# Altium schematic sheet filter.SchDoc
size A4
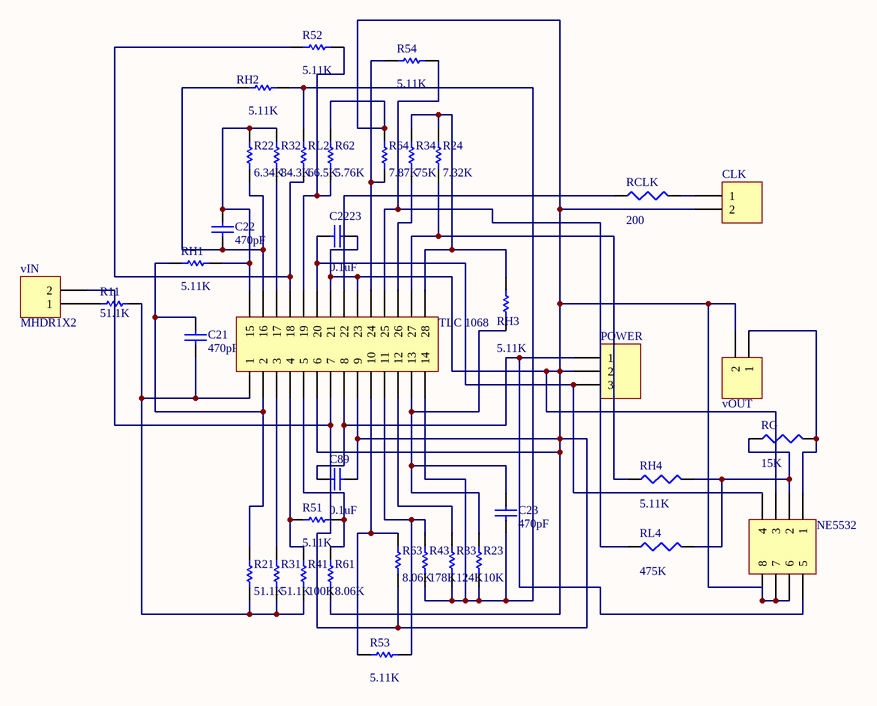
[diagram p0: filter.SchDoc]

## Parts
C21  value 470pF  [RAD-0.3]  (hidden comment: Cap)
C22  value 470pF  [RAD-0.3]  (hidden comment: Cap)
C23  value 470pF  [RAD-0.3]  (hidden comment: Cap)
C89  value 0.1uF  [RAD-0.3]  (hidden comment: Cap)
C2223  value 0.1uF  [RAD-0.3]  (hidden comment: Cap)
CLK  Header 2  [J2]  (value not drawn)
NE5532  Header 4X2A  [J8]  (value not drawn)
POWER  Header 3H  [J3]  (value not drawn)
R11  value 51.1K  [AXIAL-0.3]  (hidden comment: Res1)
R21  value 51.1K  [AXIAL-0.3]  (hidden comment: Res1)
R22  value 6.34K  [AXIAL-0.3]  (hidden comment: Res1)
R23  value 10K  [AXIAL-0.3]  (hidden comment: Res1)
R24  value 7.32K  [AXIAL-0.3]  (hidden comment: Res1)
R31  value 51.1K  [AXIAL-0.3]  (hidden comment: Res1)
R32  value 84.3K  [AXIAL-0.3]  (hidden comment: Res1)
R33  value 124K  [AXIAL-0.3]  (hidden comment: Res1)
R34  value 75K  [AXIAL-0.3]  (hidden comment: Res1)
R41  value 100K  [AXIAL-0.3]  (hidden comment: Res1)
R43  value 178K  [AXIAL-0.3]  (hidden comment: Res1)
R51  value 5.11K  [AXIAL-0.3]  (hidden comment: Res1)
R52  value 5.11K  [AXIAL-0.3]  (hidden comment: Res1)
R53  value 5.11K  [AXIAL-0.3]  (hidden comment: Res1)
R54  value 5.11K  [AXIAL-0.3]  (hidden comment: Res1)
R61  value 8.06K  [AXIAL-0.3]  (hidden comment: Res1)
R62  value 5.76K  [AXIAL-0.3]  (hidden comment: Res1)
R63  value 8.06K  [AXIAL-0.3]  (hidden comment: Res1)
R64  value 7.87K  [AXIAL-0.3]  (hidden comment: Res1)
RCLK  value 200  [AXIAL-0.3]  (hidden comment: RCLK)
RG  value 15K  [AXIAL-0.3]  (hidden comment: Res3)
RH1  value 5.11K  [AXIAL-0.3]  (hidden comment: Res1)
RH2  value 5.11K  [AXIAL-0.3]  (hidden comment: Res1)
RH3  value 5.11K  [AXIAL-0.3]  (hidden comment: Res1)
RH4  value 5.11K  [AXIAL-0.3]  (hidden comment: Res3)
RL2  value 66.5K  [AXIAL-0.3]  (hidden comment: Res1)
RL4  value 475K  [AXIAL-0.3]  (hidden comment: Res3)
TLC_1068  Header 14X2A  [J28]  (value not drawn)
vIN  MHDR1X2  [J2]
vOUT  MHDR1X2  [J2]  (value not drawn)

## Nets
NetC21_1: C21.1 R11.1 R21.1 R31.1 R41.1 TLC_1068.1
NetC21_2: C21.2 R21.2 RH1.2 TLC_1068.2
NetC22_1: C22.1 R22.1 RH2.1 TLC_1068.16
NetC22_2: C22.2 R22.2 R32.2 RH1.1 TLC_1068.15
NetC23_1: C23.1 R23.1 R33.1 R43.1 RH2.2 RL2.2 TLC_1068.14
NetC23_2: C23.2 R23.2 RH3.1 TLC_1068.13
NetC89_1: C89.1 NE5532.5 POWER.1 TLC_1068.8
NetC89_2: C89.2 C2223.2 CLK.2 NE5532.3 NE5532.6 NE5532.7 NE5532.8 POWER.2 R61.1 R62.2 R63.1 R64.2 TLC_1068.6 TLC_1068.7 TLC_1068.9 TLC_1068.21 TLC_1068.23 vIN.2 vOUT.2
NetC2223_1: C2223.1 NE5532.4 POWER.3 TLC_1068.20
NetCLK_1: CLK.1 RCLK.2
NetNE5532_1: NE5532.1 RG.2 vOUT.1
NetNE5532_2: NE5532.2 RG.1 RH4.2 RL4.2
NetR11_2: R11.2 vIN.1
NetR24_1: R24.1 RH4.1 TLC_1068.27
NetR24_2: R24.2 R34.2 RH3.2 TLC_1068.28
NetR31_2: R31.2 TLC_1068.3
NetR32_1: R32.1 TLC_1068.17
NetR33_2: R33.2 TLC_1068.12
NetR34_1: R34.1 TLC_1068.26
NetR41_2: R41.2 R51.1 TLC_1068.4
NetR43_2: R43.2 R53.2 TLC_1068.11
NetR51_2: R51.2 R61.2 TLC_1068.5
NetR52_1: R52.1 RL2.1 TLC_1068.18
NetR52_2: R52.2 R62.1 TLC_1068.19
NetR53_1: R53.1 R63.2 TLC_1068.10
NetR54_1: R54.1 RL4.1 TLC_1068.25
NetR54_2: R54.2 R64.1 TLC_1068.24
NetRCLK_1: RCLK.1 TLC_1068.22

## Library data of the parts
C21-C23 C89 C2223 = Cap: Capacitor; Published: 8-Jun-2000; LatestRevisionDate: 17-Jul-2002; LatestRevisionNote: Re-released for DXP Platform.; PackageReference: RAD-0.3; Publisher: Altium Limited; PackageDescription: Radial Cap, Thru-Hole; 2 Leads; 0.3 in Pin Spacing
CLK = Header 2: Header, 2-Pin; LatestRevisionDate: 17-Jul-2002; LatestRevisionNote: Re-released for DXP Platform.; Publisher: Altium Limited
NE5532 = Header 4X2A: Header, 4-Pin, Dual row; LatestRevisionDate: 17-Jul-2002; LatestRevisionNote: Re-released for DXP Platform.; Publisher: Altium Limited
POWER = Header 3H: Header, 3-Pin, Right Angle; LatestRevisionDate: 17-Jul-2002; LatestRevisionNote: Re-released for DXP Platform.; Publisher: Altium Limited
R11 R21-R24 R31-R34 R41 R43 R51-R54 R61-R64 RH1-RH3 RL2 = Res1: Resistor; Published: 8-Jun-2000; LatestRevisionDate: 17-Jul-2002; LatestRevisionNote: Re-released for DXP Platform.; PackageReference: AXIAL-0.3; Publisher: Altium Limited; PackageDescription: Axial Device, Thru-Hole; 2 Leads; 0.3 in Pin Spacing
RCLK RG RH4 RL4 = Res3: Resistor; Published: 8-Jun-2000; LatestRevisionDate: 29-May-2009; LatestRevisionNote: IPC-7351 Footprint Added.; PackageReference: J1-0603; Publisher: Altium Limited; PackageDescription: Chip Resistor
TLC_1068 = Header 14X2A: Header, 14-Pin, Dual row; LatestRevisionDate: 17-Jul-2002; LatestRevisionNote: Re-released for DXP Platform.; Publisher: Altium Limited
vIN vOUT = MHDR1X2: Header, 2-Pin; LatestRevisionDate: 17-Jul-2002; LatestRevisionNote: Re-released for DXP Platform.; Publisher: Altium Limited